# EAGLE design detectino (EAGLE 7.2.0)
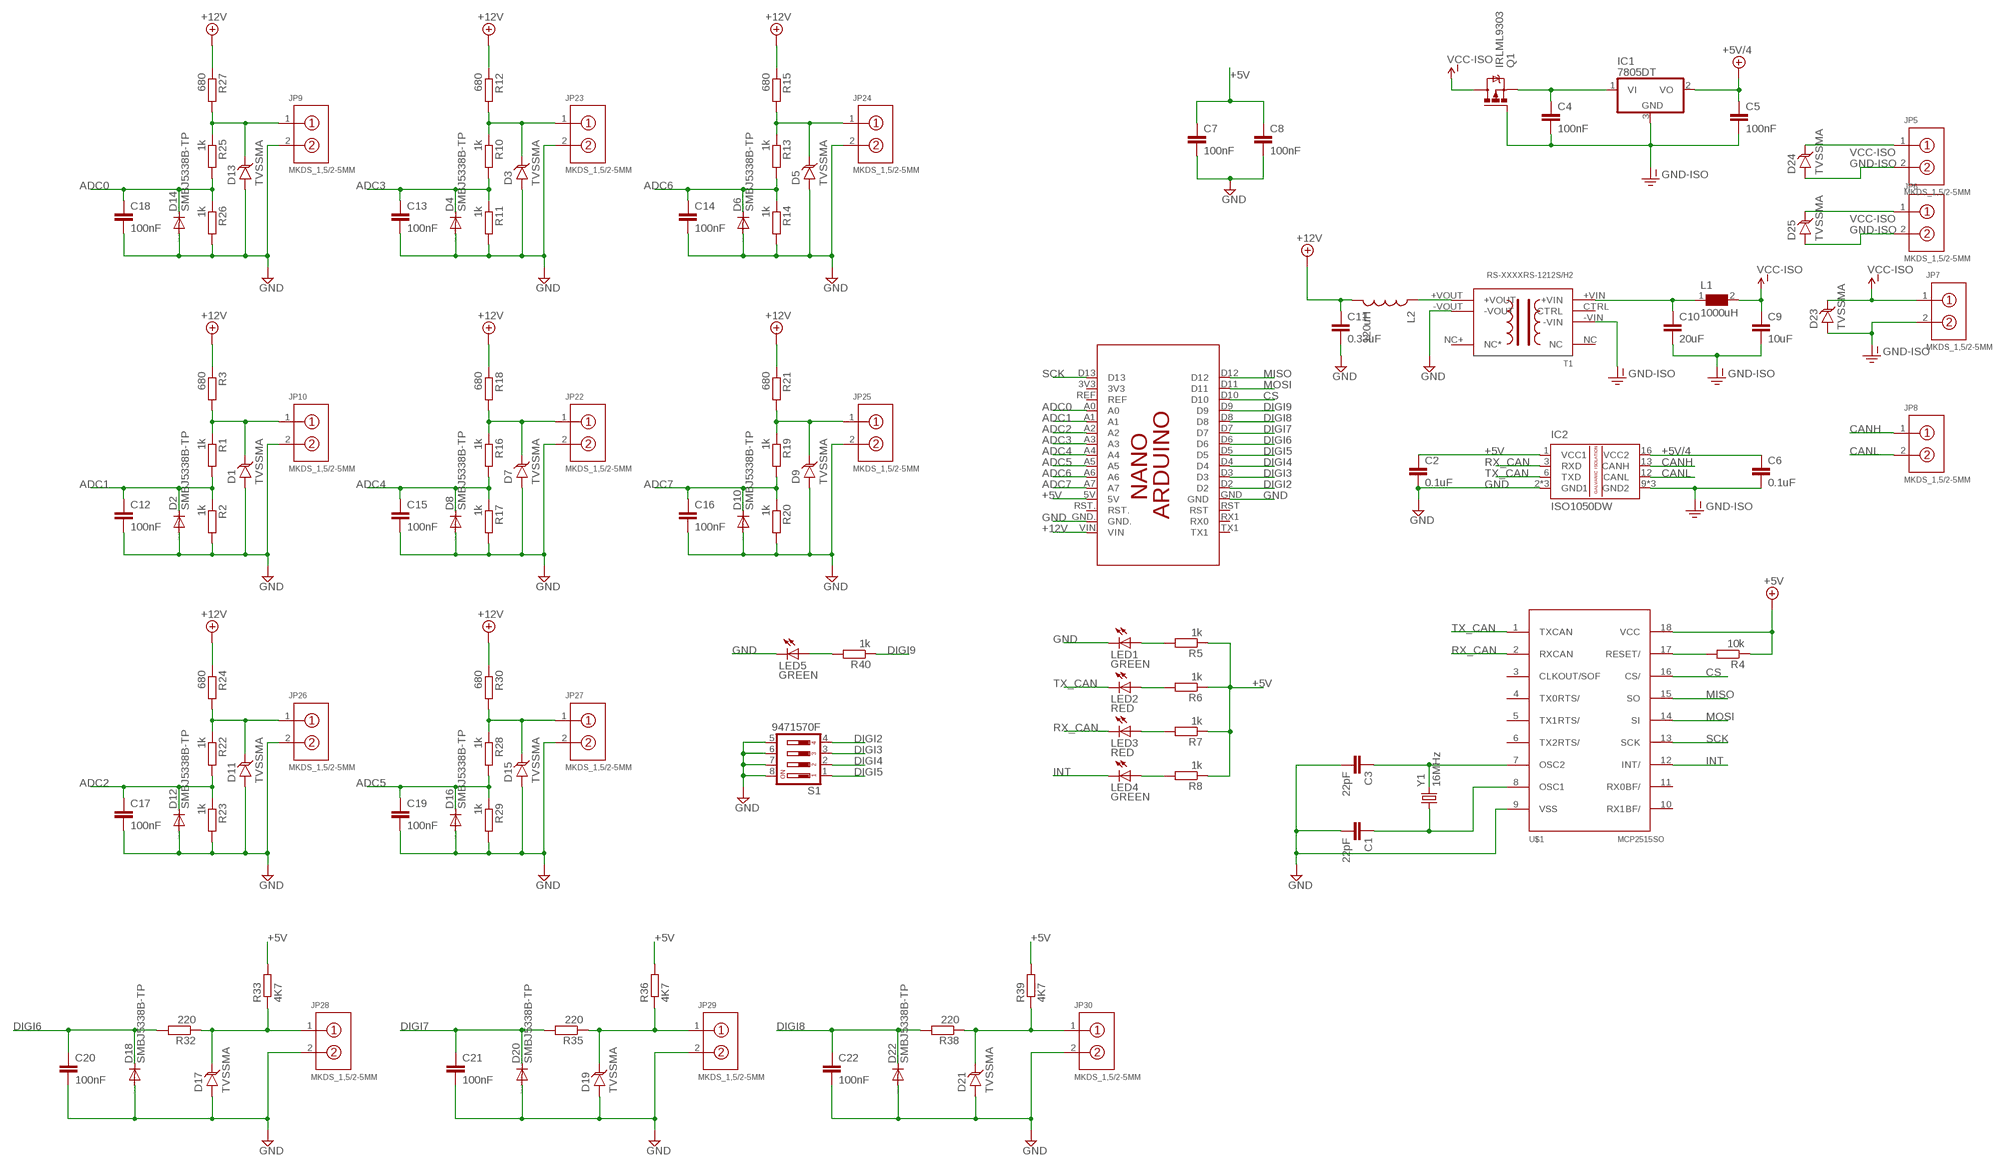
[diagram p0: schematic, sheet 1]

## Parts
C1  22pF  C-EUC1206K  [C1206K]
C2  0.1uF  C-EUC1206K  [C1206K]
C3  22pF  C-EUC1206K  [C1206K]
C4  100nF  C-EUC1206K  [C1206K]
C5  100nF  C-EUC1206K  [C1206K]
C6  0.1uF  C-EUC1206K  [C1206K]
C7  100nF  C-EUC1206K  [C1206K]
C8  100nF  C-EUC1206K  [C1206K]
C9  10uF  C-EUC1206K  [C1206K]
C10  20uF  C-EUC1206K  [C1206K]
C11  0.33uF  C-EUC1206K  [C1206K]
C12  100nF  C-EUC1206K  [C1206K]
C13  100nF  C-EUC0805K  [C0805K]
C14  100nF  C-EUC1206K  [C1206K]
C15  100nF  C-EUC1206K  [C1206K]
C16  100nF  C-EUC1206K  [C1206K]
C17  100nF  C-EUC1206K  [C1206K]
C18  100nF  C-EUC1206K  [C1206K]
C19  100nF  C-EUC0805K  [C0805K]
C20  100nF  C-EUC1206K  [C1206K]
C21  100nF  C-EUC1206K  [C1206K]
C22  100nF  C-EUC1206K  [C1206K]
D1  TVSSMA  [SMA-DIODE]
D2  SMBJ5338B-TP  DIODE-DO214AA  [DO214AA]
D3  TVSSMA  [SMA-DIODE]
D4  SMBJ5338B-TP  DIODE-DO214AA  [DO214AA]
D5  TVSSMA  [SMA-DIODE]
D6  SMBJ5338B-TP  DIODE-DO214AA  [DO214AA]
D7  TVSSMA  [SMA-DIODE]
D8  SMBJ5338B-TP  DIODE-DO214AA  [DO214AA]
D9  TVSSMA  [SMA-DIODE]
D10  SMBJ5338B-TP  DIODE-DO214AA  [DO214AA]
D11  TVSSMA  [SMA-DIODE]
D12  SMBJ5338B-TP  DIODE-DO214AA  [DO214AA]
D13  TVSSMA  [SMA-DIODE]
D14  SMBJ5338B-TP  DIODE-DO214AA  [DO214AA]
D15  TVSSMA  [SMA-DIODE]
D16  SMBJ5338B-TP  DIODE-DO214AA  [DO214AA]
D17  TVSSMA  [SMA-DIODE]
D18  SMBJ5338B-TP  DIODE-DO214AA  [DO214AA]
D19  TVSSMA  [SMA-DIODE]
D20  SMBJ5338B-TP  DIODE-DO214AA  [DO214AA]
D21  TVSSMA  [SMA-DIODE]
D22  SMBJ5338B-TP  DIODE-DO214AA  [DO214AA]
D23  TVSSMA  [SMA-DIODE]
D24  TVSSMA  [SMA-DIODE]
D25  TVSSMA  [SMA-DIODE]
IC1  7805DT  [TO252]
IC2  ISO1050DW  [SO-16DW]
JP5  MKDS_1,5/2-5MM  [MKDS_1,5/2-5MM]
JP6  MKDS_1,5/2-5MM  [MKDS_1,5/2-5MM]
JP7  MKDS_1,5/2-5MM  [MKDS_1,5/2-5MM]
JP8  MKDS_1,5/2-5MM  [MKDS_1,5/2-5MM]
JP9  MKDS_1,5/2-5MM  [MKDS_1,5/2-5MM]
JP10  MKDS_1,5/2-5MM  [MKDS_1,5/2-5MM]
JP22  MKDS_1,5/2-5MM  [MKDS_1,5/2-5MM]
JP23  MKDS_1,5/2-5MM  [MKDS_1,5/2-5MM]
JP24  MKDS_1,5/2-5MM  [MKDS_1,5/2-5MM]
JP25  MKDS_1,5/2-5MM  [MKDS_1,5/2-5MM]
JP26  MKDS_1,5/2-5MM  [MKDS_1,5/2-5MM]
JP27  MKDS_1,5/2-5MM  [MKDS_1,5/2-5MM]
JP28  MKDS_1,5/2-5MM  [MKDS_1,5/2-5MM]
JP29  MKDS_1,5/2-5MM  [MKDS_1,5/2-5MM]
JP30  MKDS_1,5/2-5MM  [MKDS_1,5/2-5MM]
L1  1000uH  WE-TIS-7447471102_1111  [WE-TIS_1111]
L2  120uH  INDUCTORSDR0403-560KL  [SDR0403]
LED1  GREEN  LEDSML1206  [SML1206]
LED2  RED  LEDSML1206  [SML1206]
LED3  RED  LEDSML1206  [SML1206]
LED4  GREEN  LEDSML1206  [SML1206]
LED5  GREEN  LEDSML1206  [SML1206]
PCB2  ARDUINO_NANO  [ARDUINO_NANO]
Q1  IRLML9303  IRLML5203  [MICRO3]
R1  1k  R-EU_R1206  [R1206]
R2  1k  R-EU_R1206  [R1206]
R3  680  R-EU_R1206  [R1206]
R4  10k  R-EU_R1206  [R1206]
R5  1k  R-EU_R1206  [R1206]
R6  1k  R-EU_R1206  [R1206]
R7  1k  R-EU_R1206  [R1206]
R8  1k  R-EU_R1206  [R1206]
R10  1k  R-EU_R1206  [R1206]
R11  1k  R-EU_R1206  [R1206]
R12  680  R-EU_R1206  [R1206]
R13  1k  R-EU_R1206  [R1206]
R14  1k  R-EU_R1206  [R1206]
R15  680  R-EU_R1206  [R1206]
R16  1k  R-EU_R1206  [R1206]
R17  1k  R-EU_R1206  [R1206]
R18  680  R-EU_R1206  [R1206]
R19  1k  R-EU_R1206  [R1206]
R20  1k  R-EU_R1206  [R1206]
R21  680  R-EU_R1206  [R1206]
R22  1k  R-EU_R1206  [R1206]
R23  1k  R-EU_R1206  [R1206]
R24  680  R-EU_M1206  [M1206]
R25  1k  R-EU_R1206  [R1206]
R26  1k  R-EU_R1206  [R1206]
R27  680  R-EU_R1206  [R1206]
R28  1k  R-EU_R1206  [R1206]
R29  1k  R-EU_R1206  [R1206]
R30  680  R-EU_R1206  [R1206]
R32  220  R-EU_R1206  [R1206]
R33  4K7  R-EU_R1206  [R1206]
R35  220  R-EU_R1206  [R1206]
R36  4K7  R-EU_R1206  [R1206]
R38  220  R-EU_R1206  [R1206]
R39  4K7  R-EU_R1206  [R1206]
R40  1k  R-EU_R1206  [R1206]
S1  9471570F  DS04  [DS-04]
T1  RS-XXXXRS-1212S/H2  [SIP8]
U$1  MCP2515SO  [SO18L]
Y1  16MHz  CRYSTALHC49US  [HC49US]

## Nets
+5V: C2.1 C7.1 C8.1 IC2.1(VCC1) PCB2.5V R4.1 R5.1 R6.1 R7.1 R8.1 R33.2 R36.2 R39.2 U$1.18(VCC)
+5V/4: C5.1 C6.1 IC1.2(VO) IC2.16(VCC2)
+12V [vcc]: C11.1 L2.P$2 PCB2.VIN R3.1 R12.1 R15.1 R18.1 R21.1 R24.1 R27.1 R30.1
ADC0: C18.1 D14.C PCB2.A0 R25.2 R26.1
ADC1: C12.1 D2.C PCB2.A1 R1.2 R2.1
ADC2: C17.1 D12.C PCB2.A2 R22.2 R23.1
ADC3: C13.1 D4.C PCB2.A3 R10.2 R11.1
ADC4: C15.1 D8.C PCB2.A4 R16.2 R17.1
ADC5: C19.1 D16.C PCB2.A5 R28.2 R29.1
ADC6: C14.1 D6.C PCB2.A6 R13.2 R14.1
ADC7: C16.1 D10.C PCB2.A7 R19.2 R20.1
CANH: IC2.13(CANH) JP8.1
CANL: IC2.12(CANL) JP8.2
CS [signal]: PCB2.D10 U$1.16(CS/)
DIGI2 [signal]: PCB2.D2 S1.4
DIGI3 [signal]: PCB2.D3 S1.3
DIGI4 [signal]: PCB2.D4 S1.2
DIGI5 [signal]: PCB2.D5 S1.1
DIGI6 [signal]: C20.1 D18.C PCB2.D6 R32.2
DIGI7 [signal]: C21.1 D20.C PCB2.D7 R35.2
DIGI8 [signal]: C22.1 D22.C PCB2.D8 R38.2
DIGI9: PCB2.D9 R40.1
GND [ground]: C1.2 C2.2 C3.2 C7.2 C8.2 C11.2 C12.2 C13.2 C14.2 C15.2 C16.2 C17.2 C18.2 C19.2 C20.2 C21.2 C22.2 D1.A D2.A D3.A D4.A D5.A D6.A D7.A D8.A D9.A D10.A D11.A D12.A D13.A D14.A D15.A D16.A D17.A D18.A D19.A D20.A D21.A D22.A IC2.2(GND1) IC2.7(GND1) IC2.8(GND1) JP9.2 JP10.2 JP22.2 JP23.2 JP24.2 JP25.2 JP26.2 JP27.2 JP28.2 JP29.2 JP30.2 LED1.C LED5.C PCB2.GND PCB2.GND. R2.2 R11.2 R14.2 R17.2 R20.2 R23.2 R26.2 R29.2 S1.5 S1.6 S1.7 S1.8 T1.-VOUT U$1.9(VSS)
GND-ISO [ground]: C4.2 C5.2 C6.2 C9.2 C10.2 D23.A D24.A D25.A IC1.3(GND) IC2.9(GND2) IC2.10(GND2) IC2.15(GND2) JP5.2 JP6.2 JP7.2 Q1.1(G) T1.-VIN
INT: LED4.C U$1.12(INT/)
MISO [signal]: PCB2.D12 U$1.15(SO)
MOSI [signal]: PCB2.D11 U$1.14(SI)
N$1: D1.C JP10.1 R1.1 R3.2
N$2 [signal]: R4.2 U$1.17(RESET/)
N$3: C1.1 U$1.8(OSC1) Y1.1
N$4: C3.1 U$1.7(OSC2) Y1.2
N$5: C4.1 IC1.1(VI) Q1.2(S)
N$6: LED1.A R5.2
N$7: LED2.A R6.2
N$8: LED3.A R7.2
N$9: LED4.A R8.2
N$10: C10.1 L1.1 T1.+VIN
N$13: D3.C JP23.1 R10.1 R12.2
N$14: D5.C JP24.1 R13.1 R15.2
N$15: D7.C JP22.1 R16.1 R18.2
N$16: D9.C JP25.1 R19.1 R21.2
N$17: D11.C JP26.1 R22.1 R24.2
N$18: D13.C JP9.1 R25.1 R27.2
N$19: D15.C JP27.1 R28.1 R30.2
N$20: L2.P$1 T1.+VOUT
N$21: D17.C JP28.1 R32.1 R33.1
N$23: D19.C JP29.1 R35.1 R36.1
N$25: D21.C JP30.1 R38.1 R39.1
N$26: LED5.A R40.2
RX_CAN [signal]: IC2.3(RXD) LED3.C U$1.2(RXCAN)
SCK [signal]: PCB2.D13 U$1.13(SCK)
TX_CAN [signal]: IC2.6(TXD) LED2.C U$1.1(TXCAN)
VCC-ISO [vcc]: C9.1 D23.C D24.C D25.C JP5.1 JP6.1 JP7.1 L1.2 Q1.3(D)
Unconnected: PCB2.3V3 PCB2.REF PCB2.RST PCB2.RST. PCB2.RX1(RX0) PCB2.TX1 T1.CTRL T1.NC T1.NC+(NC*) U$1.3(CLKOUT/SOF) U$1.4(TX0RTS/) U$1.5(TX1RTS/) U$1.6(TX2RTS/) U$1.10(RX1BF/) U$1.11(RX0BF/)

## Library data of the parts
C1-C22 = rcl:C-EU: CAPACITOR, European symbol
D1 D3 D5 D7 D9 D11 D13 D15 D17 D19 D21 D23-D25 = SparkFun-DiscreteSemi:TVS: Transient voltage suppressor- prevents ESD on inputs.
D2 D4 D6 D8 D10 D12 D14 D16 D18 D20 D22 = diode:DIODE-: DIODE
IC1 = linear:78*: Positive VOLTAGE REGULATOR Source: http://cache.national.com/ds/LM/LM78L05.pdf http://www.fairchildsemi.com/ds/LM/LM7805.pdf
IC2 = texas:ISO1050: ISOLATED CAN TRANSCEIVER Source: http://focus.ti.com/lit/ds/symlink/iso1050.pdf
JP5-JP10 JP22-JP30 = con-phonenix-mkds:MKDS_1,5/2-5MM
L1 = WE-TIS:WE-TIS: Shielded Radial Leaded Inductor - Shielded radial through-hole inductor - High rated and saturation current - High inductance values - Low stray field -- Filter choke -- Storage choke -- Class D amplifiers; MPN: 7447471102; OC_FARNELL: 2211759; OC_NEWARK: 44W4694; PACKAGE: 1111; SUPPLIER: Wuerth Elektronik
L2 = SparkFun-Passives:INDUCTOR: Inductors Basic Inductor/Choke - 0603 and 1206. Footprints are not proven and vary greatly between part numbers. SRN6045- 33uH, 20% 1.4A SDR0403-560KL - 56uH, 10%, 500mA RMS/740mA peak; DIST: DIGIKEY; DIST_ID: SDR0403-560KLCT-ND; VALUE: 56uH
LED1-LED5 = led:LED: LED OSRAM: - CHIPLED LG R971, LG N971, LY N971, LG Q971, LY Q971, LO R971, LY R971 LH N974, LH R974 LS Q976, LO Q976, LY Q976 LO Q996 - Hyper CHIPLED LW Q18S LB Q993, LB Q99A, LB R99A - SideLED LS A670, LO A670, LY A670, LG A670, LP A670 LB A673, LV A673, LT A673, LW A673 LH A674 LY A675 LS A676, LA A676, LO A676, LY A676, LW A676 LS A679, LY A679, LG A679 - Hyper Micro SIDELED® LS Y876, LA Y876, LO Y876, LY Y876 LT Y87S - SmartLED LW L88C, LW L88S LB L89C, LB L89S, LG L890 LS L89K, LO L89K, LY L89K LS L896, LA L896, LO L896, LY L896 - TOPLED LS T670, LO T670, LY T670, LG T670, LP T670 LSG T670, LSP T670, LSY T670, LOP T670, LYG T670 LG T671, LOG T671, LSG T671 LB T673, LV T673, LT T673, LW T673 LH T674 LS T676, LA T676, LO T676, LY T676, LB T676, LH T676, LSB T676, LW T676 LB T67C, LV T67C, LT T67C, LS T67K, LO T67K, LY T67K, LW E67C LS E67B, LA E67B, LO E67B, LY E67B, LB E67C, LV E67C, LT E67C LW T67C LS T679, LY T679, LG T679 LS T770, LO T770, LY T770, LG T770, LP T770 LB T773, LV T773, LT T773, LW T773 LH T774 LS E675, LA E675, LY E675, LS T675 LS T776, LA T776, LO T776, LY T776, LB T776 LHGB T686 LT T68C, LB T68C - Hyper Mini TOPLED® LB M676 - Mini TOPLED Santana® LG M470 LS M47K, LO M47K, LY M47K Source: http://www.osram.convergy.de LUXEON: - LUMILED® LXK2-PW12-R00, LXK2-PW12-S00, LXK2-PW14-U00, LXK2-PW14-V00 LXK2-PM12-R00, LXK2-PM12-S00, LXK2-PM14-U00 LXK2-PE12-Q00, LXK2-PE12-R00, LXK2-PE12-S00, LXK2-PE14-T00, LXK2-PE14-U00 LXK2-PB12-K00, LXK2-PB12-L00, LXK2-PB12-M00, LXK2-PB14-N00, LXK2-PB14-P00, LXK2-PB14-Q00 LXK2-PR12-L00, LXK2-PR12-M00, LXK2-PR14-Q00, LXK2-PR14-R00 LXK2-PD12-Q00, LXK2-PD12-R00, LXK2-PD12-S00 LXK2-PH12-R00, LXK2-PH12-S00 LXK2-PL12-P00, LXK2-PL12-Q00, LXK2-PL12-R00 Source: www.luxeon.com KINGBRIGHT: KA-3528ASYC Source: www.kingbright.com
PCB2 = E14_Arduino_published:ARDUINO_NANO: Device for representing an Arduino Nano board with a footprint in an EAGLE design. Created by Dave Young for Element14. More EAGLE documentation at: http://www.element14.com/community/community/knode/cadsoft_eagle
Q1 = transistor-power:IRLML5203: HEXFET P-Channel Power MOSFET
R1-R8 R10-R30 R32 R33 R35 R36 R38-R40 = rcl:R-EU_: RESISTOR, European symbol
S1 = switch-dil:DS04: DIL/CODE SWITCH; OC_FARNELL: 9471570; OC_NEWARK: unknown
T1 = matteo:RS-XXXX
U$1 = MCP2515_MT:MCP2515*: MCP2515 Standalone CAN-Controller by Microchip Eagle-Lib. by MartinThomas
Y1 = SparkFun-FreqCtrl:CRYSTAL: Various standard crystals. Proven footprints.

## Net classes
0 default: width 0.508 mm, clearance 0.203 mm
1 ground: width 0.508 mm, clearance 0.203 mm
2 vcc: width 0.508 mm, clearance 0.203 mm
3 signal: width 0.254 mm, clearance 0.203 mm

## Board
JP13: 710-691211720002 Mouser
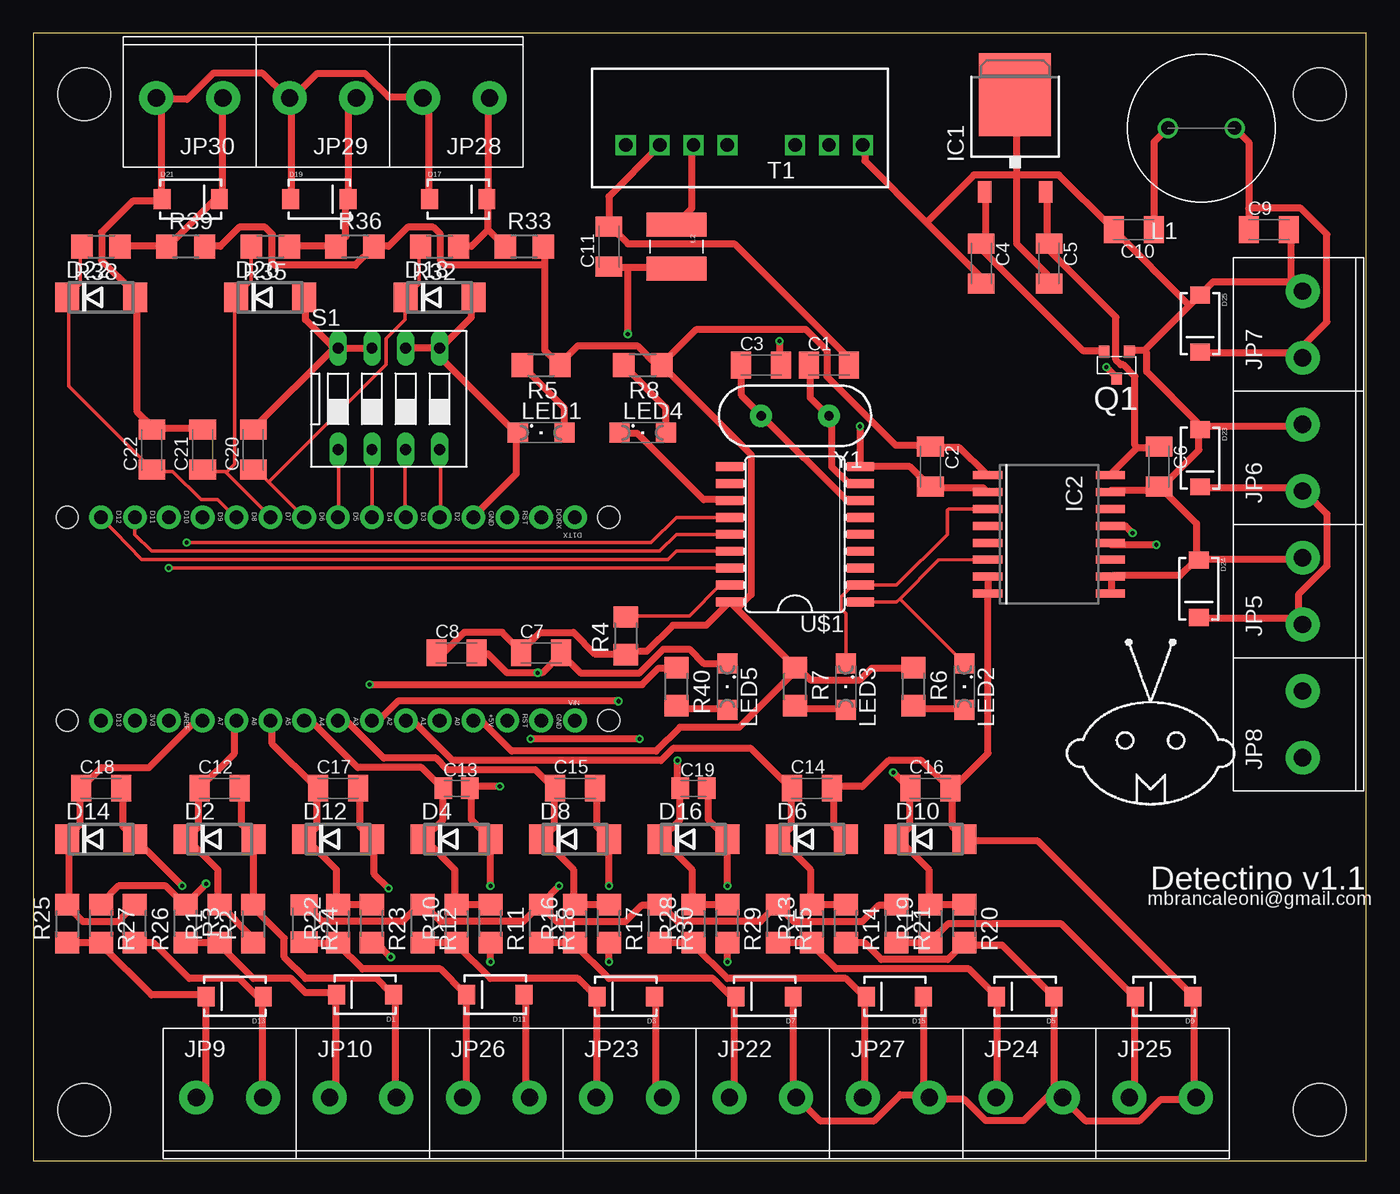
[diagram p1: board, top side]
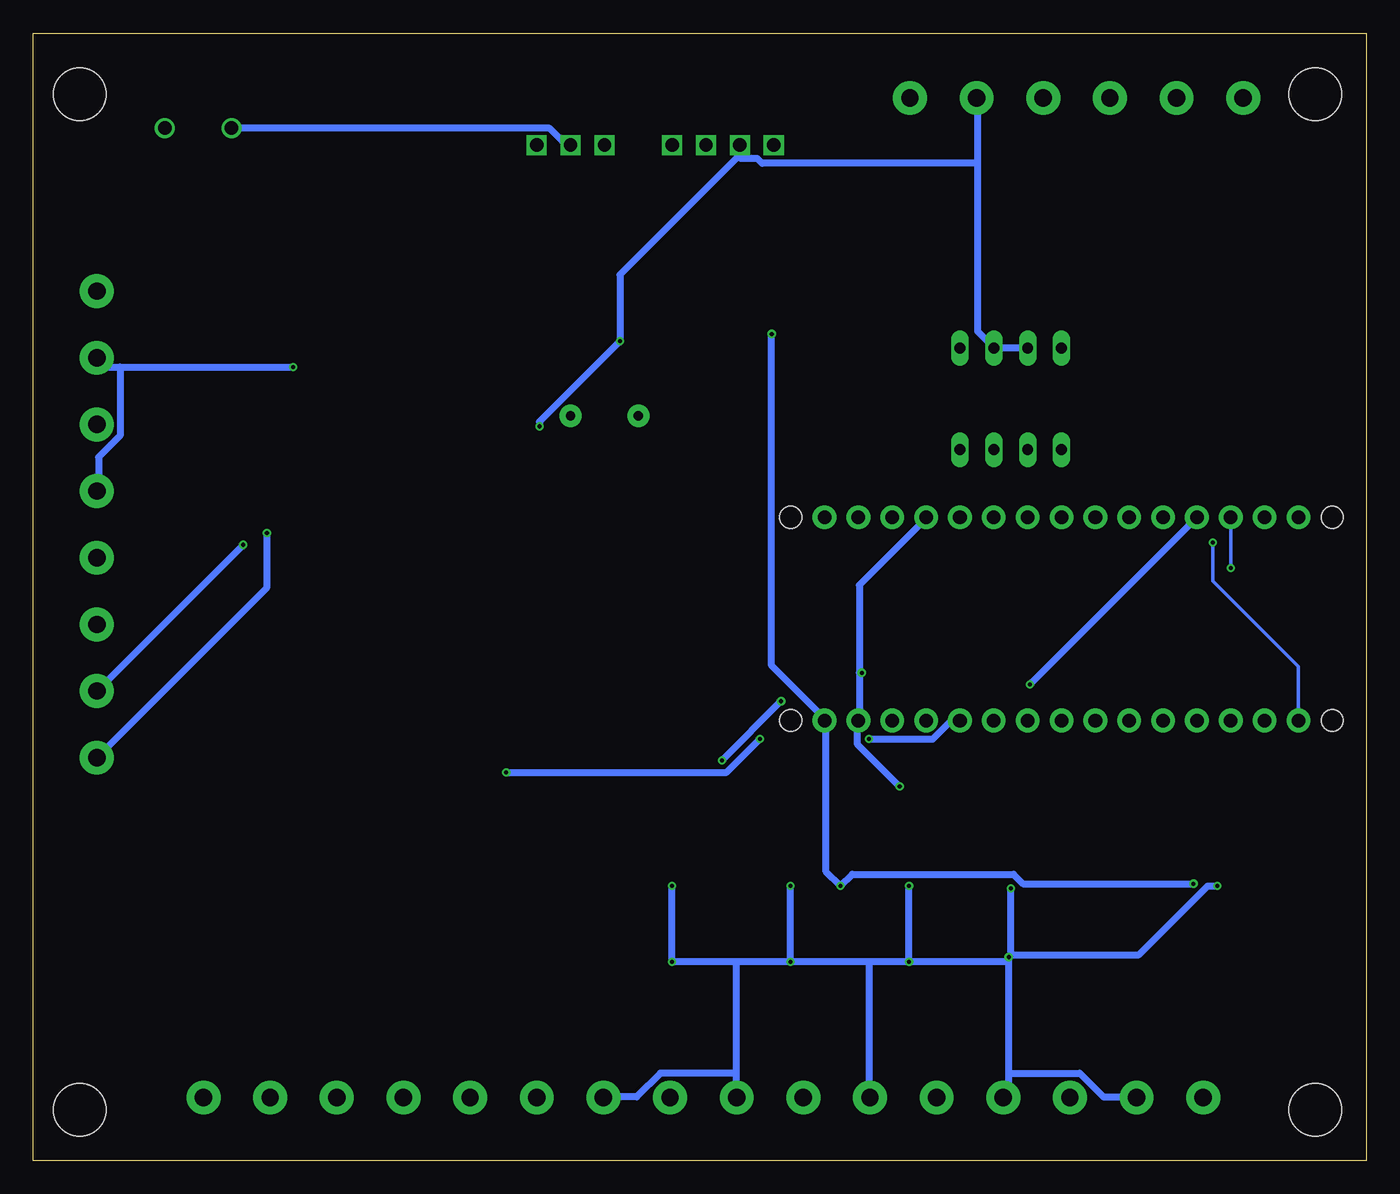
[diagram p2: board, bottom side, seen from below]

Size 100 x 84.58 mm. Coordinates in mm from the lower left corner, seen from the top.
Outline: 0,0 100,0 100,84.58 0,84.58 0,0
Copper layers (1*16): Top 0.035mm / dielectric 1.5mm / Bottom 0.035mm
Design rules "SeeedStudio_2layer_DRU_no_angle_20140221": minimum track width 6mil, minimum drill 12mil, track to track 6mil, track to pad 6mil, pad to pad 6mil, via to via 6mil, smd to smd 0mil, copper to edge 10mil, drill to drill 10mil, minimum pad ring 10mil, minimum via ring 6mil, stop-mask expansion 2mil, vias tented up to drill 100mil, thermal gap 10mil
Holes 3.96 mm at 96.52,3.81 96.52,80.01 3.81,80.01 3.81,3.81
tRestrict: area 50.8,15.2 to 100.3,84.6
bRestrict: area 50.7,15.2 to 100.3,84.5

### Footprints (pad centres in the part's own frame; a part is rotated, then mirrored left to right if it is on the bottom)
C1206K = smd 1.5 x 2: 1 -1.5,0; 2 1.5,0
C0805K = smd 1.3 x 1.6: 1 -1,0; 2 1,0
SMA-DIODE = smd 1.27 x 1.47: A -2.15,0; C 2.15,0
DO214AA = smd 1.8 x 2.2: A 2.55,0; C -2.55,0
TO252 = smd 1 x 1.6: 1 -2.28,-4.8; 2 2.28,-4.8 | smd 5.4 x 6.2: 3 0,2.5
SO-16DW = smd 0.6 x 2.2: 1 -4.445,-4.6; 2 -3.175,-4.6; 3 -1.905,-4.6; 4 -0.635,-4.6; 5 0.635,-4.6; 6 1.905,-4.6; 7 3.175,-4.6; 8 4.445,-4.6; 9 4.445,4.6; 10 3.175,4.6; 11 1.905,4.6; 12 0.635,4.6; 13 -0.635,4.6; 14 -1.905,4.6; 15 -3.175,4.6; 16 -4.445,4.6
MKDS_1,5/2-5MM = drill 1.3 pad 2.54: 1 -2.5,0; 2 2.5,0
WE-TIS_1111 = drill 1: 1 -2.5,0; 2 2.5,0
SDR0403 = smd 1.8 x 4.5: P$1 -1.65,0; P$2 1.65,0
SML1206 = smd 1.5 x 1.5: A 1.75,0; C -1.75,0
ARDUINO_NANO = drill 1.016 pad 1.778: 3V3 6.35,1.27; 5V 31.75,1.27; A0 11.43,1.27; A1 13.97,1.27; A2 16.51,1.27; A3 19.05,1.27; A4 21.59,1.27; A5 24.13,1.27; A6 26.67,1.27; A7 29.21,1.27; D2 29.21,16.51; D3 26.67,16.51; D4 24.13,16.51; D5 21.59,16.51; D6 19.05,16.51; D7 16.51,16.51; D8 13.97,16.51; D9 11.43,16.51; D10 8.89,16.51; D11 6.35,16.51; D12 3.81,16.51; D13 3.81,1.27; GND 31.75,16.51; GND. 36.83,1.27; REF 8.89,1.27; RST 34.29,16.51; RST. 34.29,1.27; RX1 36.83,16.51; TX1 39.37,16.51; VIN 39.37,1.27 | hole 1.651: 1.27,1.27; 1.27,16.51; 41.91,16.51; 41.91,1.27
MICRO3 = smd 0.8 x 0.9: 1 -0.95,-1; 2 0.95,-1; 3 0,1
R1206 = smd 1.6 x 1.803: 1 -1.422,0; 2 1.422,0
M1206 = smd 1.6 x 2: 1 -1.4,0; 2 1.4,0
DS-04 = drill 0.813 long: 1 -3.81,-3.81; 2 -1.27,-3.81; 3 1.27,-3.81; 4 3.81,-3.81; 5 3.81,3.81; 6 1.27,3.81; 7 -1.27,3.81; 8 -3.81,3.81
SIP8 = drill 1 square: +VIN -7.62,0; +VOUT 2.54,0; -VIN -10.16,0; -VOUT 5.08,0; CTRL -5.08,0; NC 0,0; NC+ 7.62,0
SO18L = smd 0.66 x 2.032: 1 -5.08,-4.902; 2 -3.81,-4.902; 3 -2.54,-4.902; 4 -1.27,-4.902; 5 0,-4.902; 6 1.27,-4.902; 7 2.54,-4.902; 8 3.81,-4.902; 9 5.08,-4.902; 10 5.08,4.902; 11 3.81,4.902; 12 2.54,4.902; 13 1.27,4.902; 14 0,4.902; 15 -1.27,4.902; 16 -2.54,4.902; 17 -3.81,4.902; 18 -5.08,4.902
HC49US = drill 0.7 pad 1.651: 1 -2.54,0; 2 2.54,0

### Placement (x,y rotation side)
C1  59.69,59.69 0 top
C2  67.31,52.07 270 top
C3  54.61,59.69 0 top
C4  71.12,67.31 270 top
C5  76.2,67.31 270 top
C6  84.45,52.07 270 top
C7  38.1,38.1 0 top
C8  31.75,38.1 0 top
C9  92.71,69.85 0 top
C10  82.55,69.85 180 top
C11  43.18,68.58 90 top
C12  13.97,27.94 0 top
C13  31.75,27.94 0 top
C14  58.42,27.94 0 top
C15  40.64,27.94 0 top
C16  67.31,27.94 0 top
C17  22.86,27.94 0 top
C18  5.08,27.94 0 top
C19  49.53,27.94 0 top
C20  16.51,53.34 90 top
C21  12.7,53.34 90 top
C22  8.89,53.34 90 top
D1  24.89,12.45 180 top
D2  13.97,24.13 0 top
D3  44.45,12.32 180 top
D4  31.75,24.13 0 top
D5  74.42,12.32 180 top
D6  58.42,24.13 0 top
D7  54.86,12.32 180 top
D8  40.64,24.13 0 top
D9  84.84,12.32 180 top
D10  67.31,24.13 0 top
D11  34.67,12.45 180 top
D12  22.86,24.13 0 top
D13  15.11,12.32 180 top
D14  5.08,24.13 0 top
D15  64.64,12.32 180 top
D16  49.53,24.13 0 top
D17  31.88,72.14 0 top
D18  30.48,64.77 0 top
D19  21.46,72.14 0 top
D20  17.78,64.77 0 top
D21  11.81,72.14 0 top
D22  5.08,64.77 0 top
D23  87.54,52.7 270 top
D24  87.44,42.91 270 top
D25  87.53,62.8 270 top
IC1  73.66,77.47 0 top
IC2  76.2,46.99 270 top
JP5  95.23,42.73 90 top
JP6  95.23,52.73 90 top
JP7  95.23,62.73 90 top
JP8  95.23,32.73 90 top
JP9  14.73,4.73 0 top
JP10  24.73,4.73 0 top
JP22  54.73,4.73 0 top
JP23  44.73,4.73 0 top
JP24  74.73,4.73 0 top
JP25  84.73,4.73 0 top
JP26  34.73,4.73 0 top
JP27  64.73,4.73 0 top
JP28  31.73,79.73 180 top
JP29  21.73,79.73 180 top
JP30  11.73,79.73 180 top
L1  87.63,77.47 0 top
L2  48.26,68.58 270 top
LED1  38.1,54.61 0 top
LED2  69.85,35.56 270 top
LED3  60.96,35.56 270 top
LED4  45.72,54.61 0 top
LED5  52.07,35.56 270 top
PCB2  1.27,31.75 0 top
Q1  81.28,59.69 180 top
R1  13.97,17.78 90 top
R2  16.51,17.78 90 top
R3  11.43,17.78 270 top
R4  44.45,39.37 90 top
R5  38.1,59.69 180 top
R6  66.04,35.56 270 top
R7  57.15,35.56 270 top
R8  45.72,59.69 180 top
R10  31.75,17.78 90 top
R11  34.29,17.78 270 top
R12  29.21,17.78 270 top
R13  58.42,17.78 90 top
R14  60.96,17.78 270 top
R15  55.88,17.78 270 top
R16  40.64,17.78 90 top
R17  43.18,17.78 270 top
R18  38.1,17.78 270 top
R19  67.31,17.78 90 top
R20  69.85,17.78 270 top
R21  64.77,17.78 270 top
R22  22.86,17.78 90 top
R23  25.4,17.78 270 top
R24  20.32,17.78 270 top
R25  2.54,17.78 90 top
R26  7.62,17.78 270 top
R27  5.08,17.78 270 top
R28  49.53,17.78 90 top
R29  52.07,17.78 270 top
R30  46.99,17.78 270 top
R32  30.48,68.58 180 top
R33  36.83,68.58 0 top
R35  17.78,68.58 180 top
R36  24.13,68.58 0 top
R38  5.08,68.58 180 top
R39  11.43,68.58 0 top
R40  48.26,35.56 270 top
S1  26.67,57.15 0 top
T1  52.07,76.2 180 top
U$1  57.15,46.99 90 top
U$5  [LOGO]  83.82,30.48 0 top
Y1  57.15,55.88 180 top

### Tracks (layer width: path | path; a pad name or v marks a point on that pad's centre or on a via)
+5V
  Top 0.508: C8.1 30.38,38.2 30.91,38.2 32.33,39.62 35.18,39.62 36.42,38.38 C7.1 36.6,38.2 38.02,39.62 40.51,39.62 42.11,38.02 44.42,38.02 R4.1 44.6,38.2 46.02,38.2 47.98,40.16 50.47,40.16 52.07,41.76 U$1.18 52.25,41.93 52.78,41.4 | 52.78,41.4 57.05,37.13 R7.1 | R6.1 65.94,36.96 62.92,36.96 62.03,36.07 58.29,36.07 57.4,36.96 R7.1 | PCB2.5V 33.04,32.87 33.76,32.87 35.89,30.73 46.74,30.73 48.51,32.51 52.96,32.51 57.23,36.78 R7.1 | R39.2 12.95,68.61 14.02,68.61 15.44,70.03 17.4,70.03 17.93,69.49 17.93,67.36 18.11,67.18 24.16,67.18 25.4,68.43 R36.2 25.76,68.61 26.64,68.61 28.07,70.03 30.02,70.03 30.56,69.49 30.56,67.54 30.91,67.18 38.38,67.18 | IC2.1 71.45,51.54 69.49,53.49 67.36,53.49 C2.1 67.18,53.67 64.69,53.67 59.54,58.83 59.54,60.78 57.94,62.38 49.76,62.38 47.27,59.89 R8.1 | 38.38,67.18 38.38,60.78 39.45,59.71 R5.1 39.62,59.89 40.87,61.14 45.31,61.14 46.74,59.71 47.09,59.71 R8.1 | 38.38,67.18 38.38,68.43 R33.2 | 52.78,41.4 53.85,42.47 53.85,52.96 47.27,59.54 R8.1
+5V/4
  Top 0.508: IC1.2 76.07,72.52 76.07,68.96 C5.1 76.25,68.61 76.25,68.25 81.23,63.27 81.23,60.07 81.59,59.71 81.76,59.71 82.65,58.83 82.65,53.67 82.83,53.49 | 82.83,53.49 84.43,53.49 C6.1 | 82.83,53.49 80.87,51.54 IC2.16
+12V  (via drill 0.3)
  Top 0.508: R21.1 64.69,19.18 63.45,19.18 62.2,17.93 57.05,17.93 55.98,19 R15.1 55.8,19.18 54.56,17.93 48.34,17.93 47.09,19.18 R30.1 46.74,19.18 45.67,19.18 44.42,17.93 39.27,17.93 38.2,19 R18.1 | 44.6,67.01 48.16,67.01 L2.P$2 | 44.6,67.01 43.18,67.01 C11.1 | R27.1 5.13,19.36 6.38,20.6 9.93,20.6 11.35,19.18 R3.1 11.53,19.36 v12.95,20.78 | R18.1 38.02,19.18 36.78,17.93 30.56,17.93 29.31,19.18 R12.1 28.96,19.18 27.71,17.93 21.67,17.93 20.42,19.18 R24.1 | v39.45,20.6 38.2,19.36 R18.1 | v44.6,62.03 44.6,67.01
  Bottom 0.508: v12.95,20.78 25.76,20.78 26.47,21.49 38.56,21.49 v39.45,20.6 40.51,21.67 40.51,32.87 PCB2.VIN 40.69,33.22 44.6,37.13 v44.6,62.03
ADC0
  Top 0.508: R26.1 7.62,19.18 6.38,17.93 3.71,17.93 2.64,19 R25.2 2.64,19.36 2.64,23.98 D14.C 2.64,24.33 3.53,25.22 3.53,27.89 C18.1 3.71,28.07 5.13,29.49 8.69,29.49 12.07,32.87 12.6,32.87 PCB2.A0
ADC1
  Top 0.508: R2.1 16.51,16.69 14.02,19.18 R1.2 13.84,19.36 13.84,21.84 11.71,23.98 D2.C 11.53,24.16 12.42,25.04 12.42,27.89 C12.1 12.6,28.07 15.09,30.56 15.09,32.87 PCB2.A1
ADC2
  Top 0.508: R23.1 25.4,19.18 22.91,19.18 R22.2 22.73,19.36 22.73,21.84 20.6,23.98 D12.C 20.42,24.16 21.31,25.04 21.31,27.89 C17.1 21.13,28.07 17.93,31.27 17.93,32.87 PCB2.A2
ADC3
  Top 0.508: R11.1 34.29,19.18 31.8,19.18 R10.2 31.62,19.36 31.62,21.84 29.49,23.98 D4.C 29.31,24.16 30.73,25.58 30.73,27.89 C13.1 30.56,28.07 29.13,29.49 24.33,29.49 20.96,32.87 20.42,32.87 PCB2.A3
ADC4
  Top 0.508: R17.1 43.18,19.18 40.69,19.18 R16.2 40.51,19.36 40.51,21.84 38.38,23.98 D8.C 38.2,24.16 39.09,25.04 39.09,27.89 C15.1 38.91,28.07 37.67,29.31 31.09,29.31 30.2,30.2 26.29,30.2 23.62,32.87 22.91,32.87 PCB2.A4
ADC5  (via drill 0.3)
  Top 0.508: R29.1 52.07,19.18 49.58,19.18 R28.2 49.4,19.36 49.4,21.84 47.27,23.98 D16.C 47.09,24.16 48.51,25.58 48.51,27.89 C19.1 48.34,28.07 v48.34,30.02 | v43.89,34.47 27.36,34.47 25.93,33.04 25.4,33.04 PCB2.A5
  Bottom 0.508: v48.34,30.02 v43.89,34.47
ADC6
  Top 0.508: R14.1 60.96,19.18 58.47,19.18 R13.2 58.29,19.36 58.29,21.84 56.16,23.98 D6.C 55.98,24.16 56.87,25.04 56.87,27.89 C14.1 56.69,28.07 53.85,30.91 47.98,30.91 47.09,30.02 31.45,30.02 28.6,32.87 28.07,32.87 PCB2.A6
ADC7  (via drill 0.3)
  Top 0.508: R20.1 69.85,19.18 67.36,19.18 R19.2 67.18,19.36 67.18,21.84 65.05,23.98 D10.C 64.87,24.16 65.76,25.04 65.76,27.89 C16.1 65.58,28.07 v64.52,29.13 | v45.49,31.62 v37.31,31.62
  Bottom 0.508: v37.31,31.62 32.51,31.62 31.27,32.87 30.56,32.87 PCB2.A7 | v45.49,31.62 47.98,29.13 v64.52,29.13
CANH  (via drill 0.3)
  Top 0.508: IC2.13 81.94,47.62 v82.47,47.09
  Bottom 0.508: v82.47,47.09 82.47,43 95.1,30.38 JP8.1
CANL  (via drill 0.3)
  Top 0.508: v84.25,46.2 80.87,46.2 IC2.12
  Bottom 0.508: v84.25,46.2 95.1,35.36 JP8.2
CS  (via drill 0.3)
  Top 0.254: U$1.16 v10.16,44.45
  Bottom 0.254: v10.16,44.45 PCB2.D10
DIGI2
  Top 0.254: S1.4 30.56,53.31 30.56,48.34 PCB2.D2
DIGI3
  Top 0.254: S1.3 27.89,53.31 27.89,48.34 PCB2.D3
DIGI4
  Top 0.254: PCB2.D4 S1.2
DIGI5
  Top 0.254: S1.1 22.91,53.31 22.91,48.34 PCB2.D5
DIGI6
  Top 0.254: R32.2 28.96,68.43 28.96,65.76 28.07,64.87 D18.C 27.89,64.69 27.89,63.09 26.47,61.67 26.47,59.71 17.67,50.91 | PCB2.D6 17.67,50.91 | 17.67,50.91 16.87,51.71 16.51,51.71 C20.1
DIGI7
  Top 0.254: R35.2 16.33,68.43 16.33,65.94 15.27,64.87 D20.C 15.09,64.69 15.09,52.25 14.46,51.62 | 14.46,51.62 17.75,48.34 PCB2.D7 | 14.46,51.62 14.38,51.71 12.78,51.71 C21.1
DIGI8
  Top 0.254: R38.2 3.53,68.43 3.53,65.76 2.64,64.87 D22.C 2.64,64.69 2.64,58.11 8.87,51.89 C22.1 9.04,51.71 10.46,51.71 12.6,49.58 13.84,49.58 15.09,48.34 PCB2.D8
DIGI9  (via drill 0.3)
  Top 0.508: v25.22,35.71 45.67,35.71 46.91,36.96 48.16,36.96 R40.1
  Bottom 0.508: v25.22,35.71 12.78,48.16 PCB2.D9
GND  (via drill 0.3)
  Top 0.508: IC2.2 71.45,50.29 71.27,50.47 67.36,50.47 C2.2 67.18,50.65 65.76,52.07 U$1.9 62.03,52.25 v62.03,55.09 | T1.-VOUT 46.91,76.07 43.18,72.34 C11.2 43.36,70.03 44.6,68.78 52.6,68.78 61.14,60.25 61.14,59.71 C1.2 | v55.98,61.49 55.98,59.71 C3.2 | C21.2 12.6,54.91 9.04,54.91 C22.2 8.87,55.09 7.8,56.16 7.8,64.69 D22.A 7.44,64.87 7.44,65.23 5.13,67.54 5.13,69.67 7.44,71.98 9.4,71.98 D21.A 9.58,72.16 9.58,79.45 9.4,79.63 JP30.2 9.75,79.63 11.53,79.63 13.49,81.59 17.22,81.59 19,79.81 JP29.2 | D17.A 29.67,72.16 29.67,79.27 29.31,79.63 JP28.2 29.13,79.81 26.64,79.81 24.87,81.59 21.31,81.59 19.53,79.81 JP29.2 | D19.A 19.36,72.16 19.36,79.63 JP29.2 | D18.A 32.87,64.69 32.87,63.27 30.56,60.96 S1.5 | S1.5 S1.6 | S1.8 22.55,60.96 16.51,54.91 C20.2 | D20.A 20.42,64.69 20.42,63.09 22.38,61.14 S1.8 | S1.8 S1.7 | LED5.C 50.29,37.31 49.22,38.38 47.27,38.38 45.49,36.6 41.05,36.6 39.62,38.02 C7.2 39.45,37.85 38.2,36.6 v37.85,36.6 35.53,36.6 34.11,38.02 33.4,38.02 C8.2 | PCB2.GND 33.04,48.34 36.25,51.54 36.25,54.56 LED1.C 36.07,54.74 30.73,60.07 30.73,60.78 S1.5 | v35,28.07 33.04,28.07 C13.2 32.87,27.89 32.87,25.58 34.29,24.16 D4.A 34.29,23.98 v34.29,20.6 | D6.A 60.96,24.16 60.07,25.04 60.07,27.89 C14.2 60.25,28.07 62.2,28.07 64.16,30.02 66.65,30.02 68.61,28.07 C16.2 | IC2.7 71.63,43.71 71.63,42.65 IC2.8 71.63,42.29 71.63,30.56 69.14,28.07 C16.2 | C16.2 68.96,27.89 68.96,25.04 69.85,24.16 D10.A 70.03,23.98 75.36,23.98 86.92,12.42 D9.A 87.1,12.24 87.1,4.78 JP25.2 86.92,4.6 84.61,4.6 83.01,3 78.92,3 77.32,4.6 JP24.2 | D15.A 66.83,12.24 66.83,5.13 67.18,4.78 JP27.2
  Top 0.508: R14.2 60.96,16.33 62.38,16.33 63.63,15.09 68.61,15.09 69.85,16.33 R20.2 70.03,16.15 72.7,16.15 76.43,12.42 D5.A 76.61,12.24 76.61,5.31 77.14,4.78 JP24.2 | JP27.2 67.36,4.6 69.85,4.6 71.45,3 74.3,3 76.43,5.13 JP24.2 | JP9.2 17.22,4.78 17.22,12.24 D13.A 17.04,12.07 15.44,13.67 11.71,13.67 9.04,16.33 7.62,16.33 R26.2 | D11.A 36.96,12.42 36.96,4.95 37.13,4.78 JP26.2 | D7.A 57.05,12.24 57.05,4.95 57.23,4.78 JP22.2 57.4,4.6 59,3 63.09,3 65.05,4.95 66.65,4.95 JP27.2 | D3.A 46.74,12.24 46.74,5.13 47.09,4.78 JP23.2 | C12.2 15.62,27.89 15.62,25.22 16.51,24.33 D2.A 16.51,23.98 R2.2 16.51,19 18.82,16.69 18.82,15.27 20.42,13.67 25.76,13.67 26.82,12.6 D1.A 27.18,12.42 27.18,4.78 JP10.2 | C15.2 42.29,27.89 42.29,25.04 43.18,24.16 D8.A 43.18,23.98 v43.18,20.6 | C17.2 24.51,27.89 24.51,25.04 25.4,24.16 D12.A 25.58,23.98 25.58,21.49 v26.64,20.42 | C18.2 6.73,27.89 6.73,25.04 7.62,24.16 D14.A 7.8,23.98 v11.18,20.6 | C19.2 50.65,27.89 50.65,25.58 52.07,24.16 D16.A 52.07,23.98 v52.07,20.6 | v26.82,15.27 25.76,16.33 25.4,16.33 R23.2 | v34.29,14.91 R11.2 | v43.18,14.91 R17.2 | v52.07,14.91 R29.2
  Bottom 0.508: 47.09,75.36 55.98,66.47 v55.98,61.49 62.03,55.45 v62.03,55.09 | 47.09,75.36 47.09,76.07 T1.-VOUT | S1.7 S1.6 28.07,61.14 29.13,62.2 29.13,74.83 | 38.02,36.6 38.02,43.18 33.04,48.16 PCB2.GND | 38.02,36.6 38.02,33.04 PCB2.GND. 38.2,32.87 38.2,31.27 v35,28.07 | v37.85,36.6 38.02,36.6 | 29.13,74.83 29.13,79.63 JP28.2 | 29.13,74.83 45.31,74.83 45.67,75.18 46.91,75.18 47.09,75.36 | 26.82,6.55 26.82,5.13 27.18,4.78 JP10.2 | 26.82,6.55 26.82,14.91 | 26.82,14.91 v26.82,15.27 26.64,15.44 | 26.82,14.91 v34.29,14.91 | v34.29,14.91 37.31,14.91 | 37.31,14.91 v43.18,14.91 | v43.18,14.91 47.27,14.91 | 47.27,14.91 v52.07,14.91 v52.07,20.6 | v11.18,20.6 11.89,20.6 17.04,15.44 26.64,15.44 | 26.64,15.44 v26.64,20.42 | v43.18,14.91 v43.18,20.6 | 47.27,14.91 47.27,6.55 | 47.27,6.55 47.27,4.78 JP23.2 | 47.27,6.55 52.96,6.55 54.74,4.78 57.23,4.78 JP22.2 | 37.31,14.91 37.31,4.78 JP26.2 | 26.82,6.55 21.49,6.55 19.71,4.78 17.4,4.78 JP9.2 | v34.29,14.91 v34.29,20.6
GND-ISO
  Top 0.508: 67.01,70.38 62.38,75.01 62.38,76.07 T1.-VIN | 67.01,70.38 71.09,66.29 71.09,65.94 C4.2 | 73.76,73.94 73.76,79.81 IC1.3 | 73.76,73.94 73.76,68.78 76.07,66.47 76.07,65.94 C5.2 | 67.01,70.38 70.56,73.94 73.76,73.94 | C9.2 94.39,69.85 94.39,66.12 95.1,65.41 JP7.2 94.21,65.94 88.52,65.94 87.63,65.05 D25.A 87.45,64.87 86.74,64.16 | 83.36,60.78 82.3,60.78 Q1.1 | 86.74,64.16 83.36,60.78 | 86.74,64.16 C10.2 80.87,70.03 76.96,73.94 73.76,73.94 | IC2.9 80.87,42.65 80.87,43.71 IC2.10 81.05,43.89 86.03,43.89 87.1,44.96 D24.A | D24.A 87.27,45.14 87.27,47.8 84.61,50.47 C6.2 | D23.A 87.45,54.74 87.45,53.31 84.79,50.65 C6.2 | IC2.15 80.87,50.29 84.43,50.29 C6.2 | JP5.2 95.1,45.14 87.63,45.14 D24.A | JP6.2 95.1,55.09 87.63,55.09 D23.A | 83.36,60.78 83.54,60.6 83.54,59.18 87.45,55.27 D23.A
INT
  Top 0.508: LED4.C 44.07,54.56 45.31,54.56 50.29,49.58 52.25,49.58 U$1.12
MISO
  Top 0.254: U$1.15 48.26,45.72 47.62,45.11 8.13,45.11 PCB2.D12
MOSI
  Top 0.254: U$1.14 48.26,46.99 46.99,45.72 8.89,45.72 7.62,46.99 PCB2.D11
N$1
  Top 0.508: R3.2 11.53,16.33 13.84,16.33 R1.1 14.02,16.15 16.51,13.67 19.36,13.67 20.42,12.6 22.55,12.6 D1.C 22.73,12.42 22.73,5.13 22.38,4.78 JP10.1
N$2
  Top 0.254: U$1.17 51.54,43.18 49.22,40.87 44.6,40.87 R4.2
N$3
  Top 0.508: C1.1 58.29,59.54 58.29,57.23 59.54,55.98 Y1.1 59.89,55.8 59.89,52.07 61.14,50.82 62.03,50.82 U$1.8
N$4
  Top 0.508: C3.1 53.14,59.54 53.14,57.4 54.56,55.98 Y1.2 54.74,55.8 60.96,49.58 62.03,49.58 U$1.7
N$5
  Top 0.508: Q1.2 80.16,60.78 78.74,60.78 71.27,68.25 71.27,68.78 C4.1 71.45,68.96 71.45,72.52 IC1.1
N$6
  Top 0.508: LED1.A 39.8,54.74 39.8,56.51 36.78,59.54 R5.2
N$7
  Top 0.508: LED2.A 69.85,33.93 66.29,33.93 66.12,34.11 R6.2
N$8
  Top 0.508: LED3.A 60.96,33.93 57.4,33.93 57.23,34.11 R7.2
N$9
  Top 0.508: LED4.A 47.45,54.74 47.45,56.51 44.42,59.54 R8.2
N$10
  Top 0.508: C10.1 84.07,69.85 84.07,76.43 84.96,77.32 L1.1
  Bottom 0.508: T1.+VIN 59.71,76.25 60.07,76.25 61.32,77.5 84.96,77.5 L1.1
N$13
  Top 0.508: R12.2 29.31,16.33 31.62,16.33 R10.1 31.8,16.15 34.29,13.67 40.87,13.67 42.11,12.42 D3.C 42.29,12.24 42.29,4.78 JP23.1
N$14
  Top 0.508: R15.2 55.98,16.33 58.29,16.33 R13.1 58.47,16.15 60.25,14.38 70.21,14.38 72.16,12.42 D5.C 72.34,12.24 72.34,4.78 JP24.1
N$15
  Top 0.508: R18.2 38.2,16.33 40.51,16.33 R16.1 40.69,16.15 43.18,13.67 51,13.67 52.43,12.24 D7.C 52.6,12.24 52.6,5.13 52.25,4.78 JP22.1
N$16
  Top 0.508: R21.2 64.87,16.33 67.18,16.33 R19.1 67.36,16.51 68.61,17.75 77.14,17.75 82.47,12.42 D9.C 82.65,12.24 82.65,5.13 82.3,4.78 JP25.1
N$17
  Top 0.508: R24.2 20.42,16.33 22.73,16.33 R22.1 22.91,16.15 24.69,14.38 30.56,14.38 32.33,12.6 D11.C 32.51,12.42 32.51,4.95 32.33,4.78 JP26.1
N$18
  Top 0.508: R25.1 2.64,16.33 4.95,16.33 R27.2 5.13,16.15 8.87,12.42 12.78,12.42 D13.C 12.95,12.24 12.95,5.49 12.24,4.78 JP9.1
N$19
  Top 0.508: R30.2 47.09,16.33 49.4,16.33 R28.1 49.58,16.15 52.07,13.67 60.96,13.67 62.2,12.42 D15.C 62.38,12.24 62.38,4.78 JP27.1
N$20
  Top 0.508: T1.+VOUT 49.4,76.07 49.4,71.45 48.34,70.38 L2.P$1
N$21
  Top 0.508: 34.11,69.85 34.11,71.98 D17.C 34.11,72.34 34.11,79.63 JP28.1 | 34.11,69.85 35.36,68.61 R33.1 | 34.11,69.85 32.87,68.61 31.98,68.61 R32.1
N$23
  Top 0.508: R35.1 19.36,68.61 22.55,68.61 R36.1 22.73,68.61 23.44,69.32 23.44,71.98 D19.C 23.62,72.34 23.62,79.1 24.16,79.63 JP29.1
N$25
  Top 0.508: R38.1 6.55,68.61 9.75,68.61 R39.1 10.11,68.61 13.49,71.98 13.84,71.98 D21.C 14.2,72.16 14.2,79.63 JP30.1
N$26
  Top 0.508: LED5.A 52.07,33.93 48.51,33.93 48.34,34.11 R40.2
RX_CAN
  Top 0.254: IC2.3 68.68,48.89 68.58,48.79 68.58,46.99 64.77,43.18 U$1.2 61.49,43.18 60.6,42.29 60.6,41.4 60.96,41.05 LED3.C
SCK  (via drill 0.3)
  Top 0.254: U$1.13 48.26,48.26 46.35,46.38 v11.51,46.38
  Bottom 0.254: PCB2.D13 5.08,37.06 11.51,43.48 v11.51,46.38
TX_CAN
  Top 0.254: U$1.1 64.77,41.91 65.01,42.15 | 65.01,42.15 67.92,45.06 IC2.6 | 65.01,42.15 LED2.C
VCC-ISO  (via drill 0.3)
  Top 0.508: D24.C 87.45,40.69 94.74,40.69 95.1,40.33 JP5.1 94.92,40.87 94.92,42.47 97.05,44.6 97.05,48.51 95.45,50.11 JP6.1 95.1,50.29 94.92,50.47 87.63,50.47 D23.C | 91.19,71.45 91.19,76.43 90.3,77.32 L1.2 | 91.19,71.45 91.19,69.85 C9.1 | v80.52,59.54 81.23,58.83 Q1.3 | D25.C 87.63,60.6 94.74,60.6 95.1,60.25 JP7.1 94.92,60.78 97.05,62.92 97.05,69.49 95.1,71.45 91.19,71.45
  Bottom 0.508: 93.5,59.54 94.56,59.54 95.1,60.07 JP7.1 | 93.5,59.54 v80.52,59.54 | 93.5,59.54 93.5,54.38 95.1,52.78 95.1,50.29 JP6.1

### Text on the board
tPlace: Detectino v1.1 | mbrancaleoni@gmail.com